# EAGLE design counter_test (EAGLE 6.4)
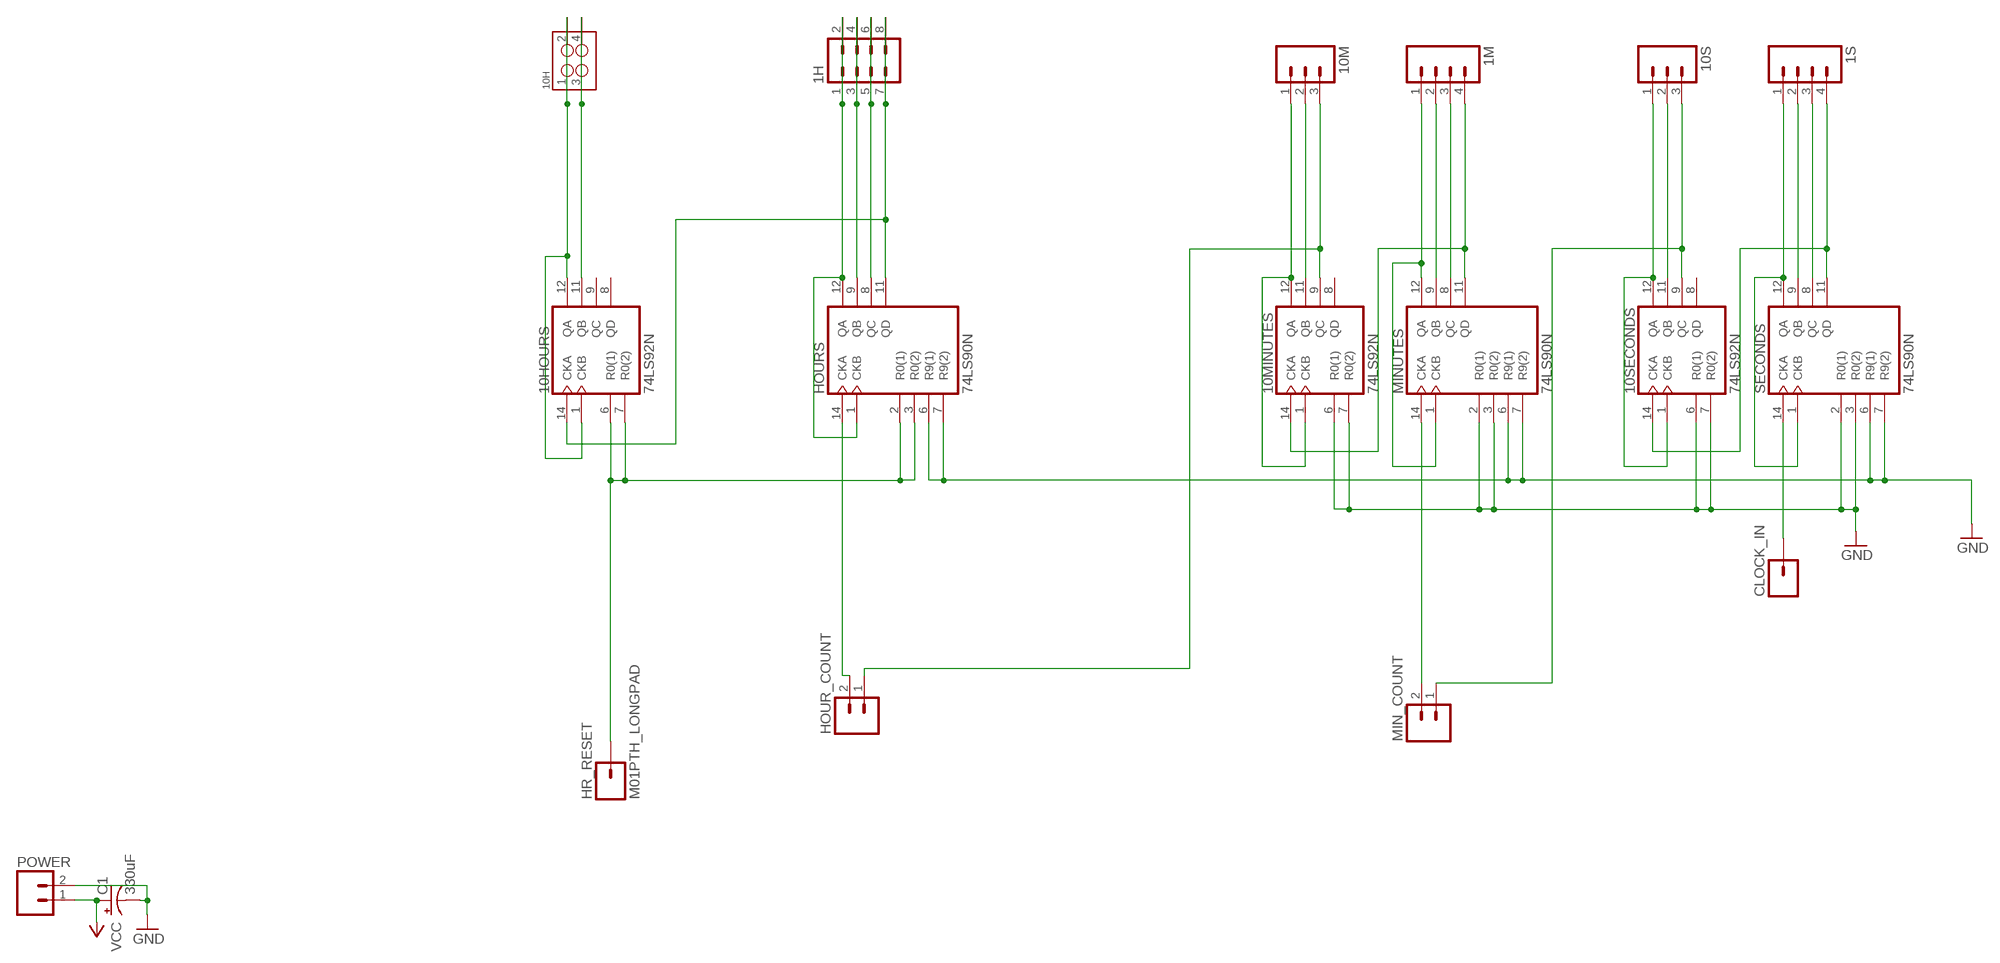
[diagram p0: schematic, sheet 1]

## Parts
1H  M04X2  [2X4]
1M  M04LONGPADS  [1X04_LONGPADS]
1S  M04LONGPADS  [1X04_LONGPADS]
10H  M02X2  [2X2]
10HOURS  74LS92N  [DIL14]
10M  M03LONGPADS  [1X03_LONGPADS]
10MINUTES  74LS92N  [DIL14]
10S  M03LONGPADS  [1X03_LONGPADS]
10SECONDS  74LS92N  [DIL14]
C1  330uF  CAPACITOR_POLE3.5-8  [E3,5-8]
CLOCK_IN  M01PTH_LONGPAD  [1X01_LONGPAD]
HOUR_COUNT  M02PTH3  [1X02_LONGPADS]
HOURS  74LS90N  [DIL14]
HR_RESET  M01PTH_LONGPAD  [1X01_LONGPAD]
MIN_COUNT  M02PTH3  [1X02_LONGPADS]
MINUTES  74LS90N  [DIL14]
POWER  M02PTH3  [1X02_LONGPADS]
SECONDS  74LS90N  [DIL14]

## Nets
1H_A: 1H.1 1H.2 HOURS.1(CKB) HOURS.12(QA)
1H_B: 1H.3 1H.4 HOURS.9(QB)
1H_C: 1H.5 1H.6 HOURS.8(QC)
1H_D: 1H.7 1H.8 10HOURS.14(CKA) HOURS.11(QD)
1M_A: 1M.1 MINUTES.1(CKB) MINUTES.12(QA)
1M_B: 1M.2 MINUTES.9(QB)
1M_C: 1M.3 MINUTES.8(QC)
1M_D: 1M.4 10MINUTES.14(CKA) MINUTES.11(QD)
1S_A: 1S.1 SECONDS.1(CKB) SECONDS.12(QA)
1S_B: 1S.2 SECONDS.9(QB)
1S_C: 1S.3 SECONDS.8(QC)
1S_D: 1S.4 10SECONDS.14(CKA) SECONDS.11(QD)
10H_A: 10H.1 10H.2 10HOURS.1(CKB) 10HOURS.12(QA)
10H_B: 10H.3 10H.4 10HOURS.11(QB)
10M_A: 10M.1 10MINUTES.1(CKB) 10MINUTES.12(QA)
10M_B: 10M.2 10MINUTES.11(QB)
10M_C: 10M.3 10MINUTES.9(QC) HOUR_COUNT.1
10S_A: 10S.1 10SECONDS.1(CKB) 10SECONDS.12(QA)
10S_B: 10S.2 10SECONDS.11(QB)
10S_C: 10S.3 10SECONDS.9(QC) MIN_COUNT.1
GND: 10MINUTES.6(R0(1)) 10MINUTES.7(R0(2)) 10SECONDS.6(R0(1)) 10SECONDS.7(R0(2)) C1.- HOURS.6(R9(1)) HOURS.7(R9(2)) MINUTES.2(R0(1)) MINUTES.3(R0(2)) MINUTES.6(R9(1)) MINUTES.7(R9(2)) POWER.2 SECONDS.2(R0(1)) SECONDS.3(R0(2)) SECONDS.6(R9(1)) SECONDS.7(R9(2))
HR_RESET: 10HOURS.6(R0(1)) 10HOURS.7(R0(2)) HOURS.2(R0(1)) HOURS.3(R0(2)) HR_RESET.1
N$1: MIN_COUNT.2 MINUTES.14(CKA)
N$15: CLOCK_IN.1 SECONDS.14(CKA)
N$21: HOUR_COUNT.2 HOURS.14(CKA)
VCC: C1.+ POWER.1
Unconnected: 10HOURS.8(QD) 10HOURS.9(QC) 10MINUTES.8(QD) 10SECONDS.8(QD)

## Power pins joined to a net without a drawn wire
GND: 10HOURS.10(GND) 10MINUTES.10(GND) 10SECONDS.10(GND) HOURS.10(GND) MINUTES.10(GND) SECONDS.10(GND)
VCC: 10HOURS.5(VCC) 10MINUTES.5(VCC) 10SECONDS.5(VCC) HOURS.5(VCC) MINUTES.5(VCC) SECONDS.5(VCC)

## Library data of the parts
1H = iStivi - Header-Connector:M04X2: .1" header, two rows of four.
1M 1S = iStivi - Header-Connector:M04: Header 4 Standard 4-pin 0.1" header. Use with straight break away headers (SKU : PRT-00116), right angle break away headers (PRT-00553), swiss pins (PRT-00743), machine pins (PRT-00117), and female headers (PRT-00115). Molex polarized connector foot print use with SKU : PRT-08231 with associated crimp pins and housings. 1MM SMD Version SKU: PRT-10208
10H = iStivi - Header-Connector:M02X2
10HOURS 10MINUTES 10SECONDS = iStivi - ICs:74*92: Divide by 12 counter
10M 10S = iStivi - Header-Connector:M03: Header 3 Standard 3-pin 0.1" header. Use with straight break away headers (SKU : PRT-00116), right angle break away headers (PRT-00553), swiss pins (PRT-00743), machine pins (PRT-00117), and female headers (PRT-00115). Molex polarized connector foot print use with SKU : PRT-08232 with associated crimp pins and housings.
C1 = iStivi - RCLD:CAPACITOR_POL: POLARIZED CAPACITOR, American symbol
CLOCK_IN HR_RESET = iStivi - Header-Connector:M01: Header 1 Standard 1-pin 0.1" header. Use with straight break away headers (SKU : PRT-00116), right angle break away headers (PRT-00553), swiss pins (PRT-00743), machine pins (PRT-00117), and female headers (PRT-00115).
HOUR_COUNT MIN_COUNT POWER = iStivi - Header-Connector:M02: Header 2 Standard 2-pin 0.1" header. Use with straight break away headers (SKU : PRT-00116), right angle break away headers (PRT-00553), swiss pins (PRT-00743), machine pins (PRT-00117), and female headers (PRT-00115). Molex polarized connector foot print use with SKU : PRT-08233 with associated crimp pins and housings.
HOURS MINUTES SECONDS = iStivi - ICs:74*90: Decade Counter BCD decade counter

## Board
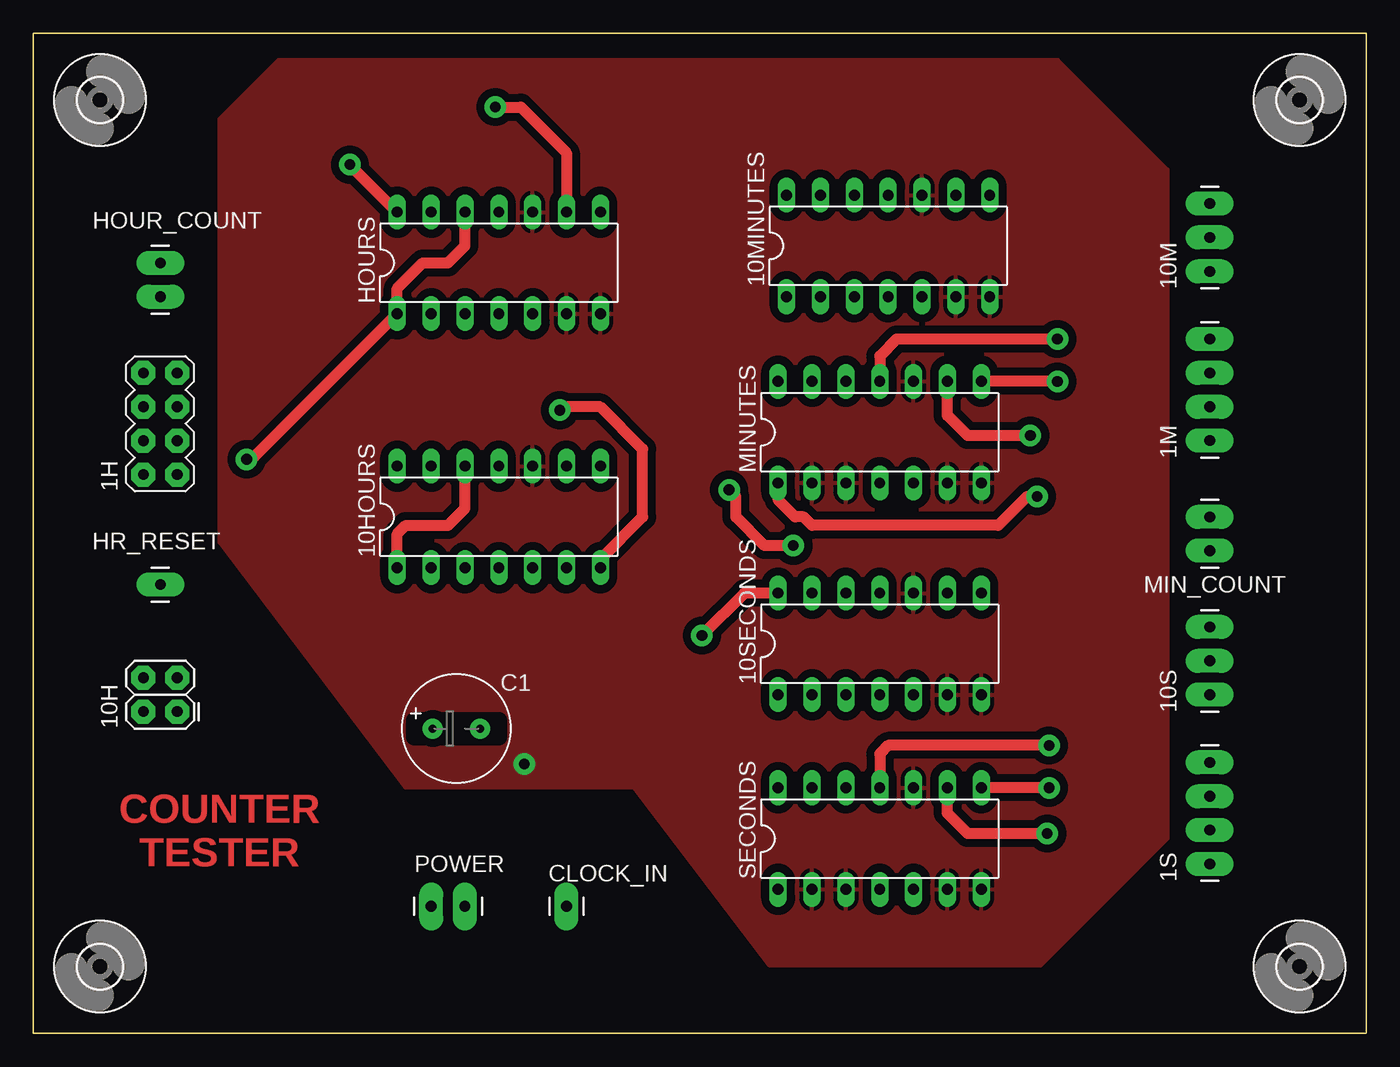
[diagram p1: board, top side]
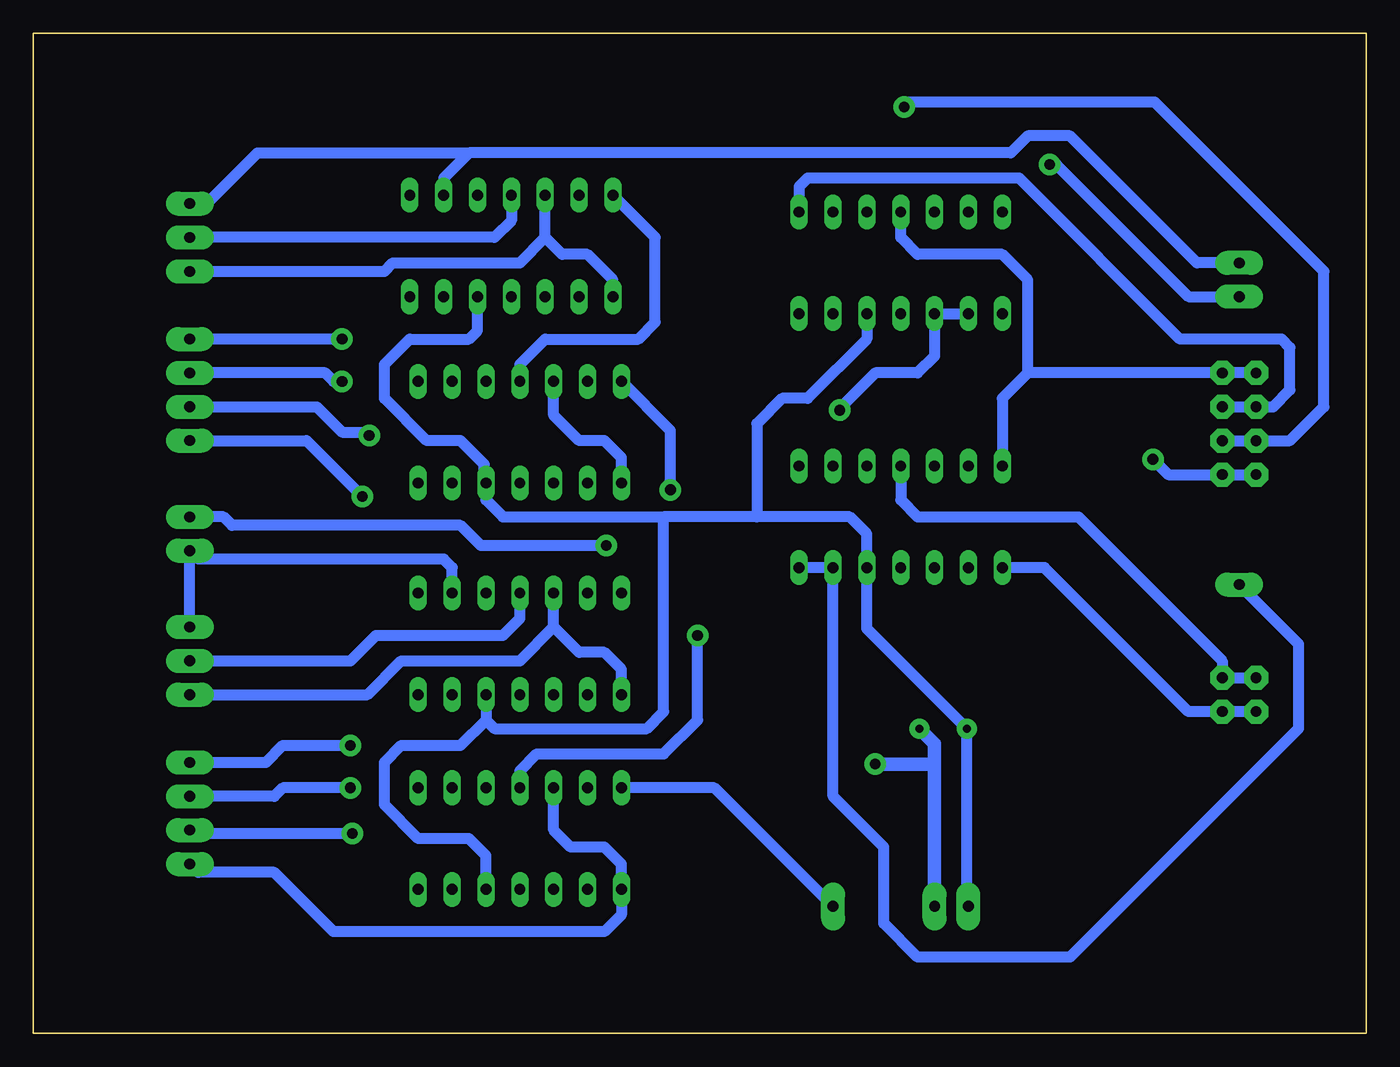
[diagram p2: board, bottom side, seen from below]

Size 100 x 75 mm. Coordinates in mm from the lower left corner, seen from the top.
Copper layers (1*16): Top 0.035mm / dielectric 1.5mm / Bottom 0.035mm
Design rules "iStivi-0.8mm via-16mil-track-12gap *": minimum track width 16mil, minimum drill 0.8mm, track to track 16mil, track to pad 16mil, pad to pad 10mil, via to via 12mil, smd to smd 10mil, copper to edge 40mil, drill to drill 8mil, minimum pad ring 10mil, minimum via ring 16mil, stop-mask expansion 0mil, vias tented up to drill 0mil, thermal gap 12mil
tRestrict: area 7.6,54 to 11.4,59.1; area 7,40.6 to 12.1,50.8; area 7.6,32.4 to 11.4,34.9; area 7,22.9 to 12.1,27.9; area 28.6,7.6 to 33.7,11.4; area 38.7,7.6 to 41.3,11.4; area 86.4,11.4 to 90.2,21.6; area 86.4,24.1 to 90.2,31.1; area 86.4,34.9 to 90.2,40; area 86.4,43.2 to 90.2,53.3; area 86.4,55.9 to 90.2,63.5; area 28.6,22.2 to 34.9,23.5

### Footprints (pad centres in the part's own frame; a part is rotated, then mirrored left to right if it is on the bottom)
2X4 = drill 0.8 pad 1.8 octagon: 1 -3.81,-1.27; 2 -3.81,1.27; 3 -1.27,-1.27; 4 -1.27,1.27; 5 1.27,-1.27; 6 1.27,1.27; 7 3.81,-1.27; 8 3.81,1.27
1X04_LONGPADS = drill 0.8 pad 1.8 long: 1 0,0; 2 2.54,0; 3 5.08,0; 4 7.62,0
2X2 = drill 0.8 pad 1.8 octagon: 1 -1.27,-1.27; 2 -1.27,1.27; 3 1.27,-1.27; 4 1.27,1.27
DIL14 = drill 0.813 long: 1 -7.62,-3.81; 2 -5.08,-3.81; 3 -2.54,-3.81; 4 0,-3.81; 5 2.54,-3.81; 6 5.08,-3.81; 7 7.62,-3.81; 8 7.62,3.81; 9 5.08,3.81; 10 2.54,3.81; 11 0,3.81; 12 -2.54,3.81; 13 -5.08,3.81; 14 -7.62,3.81
1X03_LONGPADS = drill 0.8 pad 1.8 long: 1 0,0; 2 2.54,0; 3 5.08,0
E3,5-8 = drill 0.6 pad 1.5: + -1.778,0; - 1.778,0
1X01_LONGPAD = drill 0.8 pad 1.8 long: 1 0,0
1X02_LONGPADS = drill 0.8 pad 1.8 long: 1 0,0; 2 2.54,0

### Placement (x,y rotation side)
1H  9.53,45.72 90 top
1M  88.27,44.45 90 top
1S  88.27,12.7 90 top
10H  9.53,25.4 90 top
10HOURS  34.92,38.73 0 top
10M  88.27,57.15 90 top
10MINUTES  64.14,59.05 0 top
10S  88.27,25.4 90 top
10SECONDS  63.5,29.21 0 top
C1  31.75,22.86 0 top
CLOCK_IN  40.01,9.53 0 top
HOUR_COUNT  9.53,57.78 270 top
HOURS  34.92,57.78 0 top
HR_RESET  9.53,33.66 90 top
MIN_COUNT  88.27,36.2 90 top
MINUTES  63.5,45.09 0 top
POWER  29.84,9.53 0 top
SECONDS  63.5,14.61 0 top
U$1  [BOARD-75X100]  0,0 0 top

### Tracks (layer width: path | path; a pad name or v marks a point on that pad's centre or on a via)
1H_A  (via drill 0.8)
  Top 0.813: v16,43.05 16.38,43.05 HOURS.1 27.3,55.88 29.21,57.78 31.11,57.78 32.38,59.05 HOURS.12
  Bottom 0.813: v16,43.05 14.86,41.91 1H.1 1H.2
1H_B  (via drill 0.8)
  Top 0.813: v34.67,69.47 36.58,69.47 40.01,66.04 HOURS.9
  Bottom 0.813: 1H.3 1H.4 5.71,44.45 3.17,46.99 3.17,57.15 15.88,69.85 34.29,69.85 v34.67,69.47
1H_C
  Bottom 0.813: 1H.5 1H.6 6.99,46.99 5.71,48.26 5.71,51.44 6.35,52.07 13.97,52.07 26.04,64.14 41.91,64.14 42.55,63.5 HOURS.8
1H_D
  Bottom 0.813: 1H.8 1H.7 | 11.43,49.53 1H.7 | 1H.7 25.4,49.53 | 25.4,49.53 27.3,47.62 10HOURS.14 | 25.4,49.53 25.4,56.52 27.3,58.42 33.66,58.42 34.92,59.69 HOURS.11
1M_A  (via drill 0.8)
  Top 0.813: v75.31,40.26 74.55,40.26 72.39,38.1 58.42,38.1 57.78,38.73 57.15,38.73 55.88,40.01 MINUTES.1
  Bottom 0.813: 1M.1 79.5,44.45 v75.31,40.26 | MINUTES.1 55.88,43.18 57.15,44.45 59.05,44.45 60.96,46.35 MINUTES.12
1M_B  (via drill 0.8)
  Top 0.813: v74.8,44.83 70.1,44.83 68.58,46.35 MINUTES.9
  Bottom 0.813: 1M.2 78.74,46.99 76.83,45.09 75.06,45.09 v74.8,44.83
1M_C  (via drill 0.8)
  Top 0.813: v76.83,48.9 MINUTES.8
  Bottom 0.813: v76.83,48.9 77.47,48.9 78.11,49.53 1M.3
1M_D  (via drill 0.8)
  Top 0.813: v76.83,52.07 64.77,52.07 63.5,50.8 MINUTES.11
  Bottom 0.813: v76.83,52.07 1M.4 | MINUTES.11 63.5,50.16 61.59,52.07 54.61,52.07 53.34,53.34 53.34,59.69 10MINUTES.14
1S_A
  Bottom 0.813: SECONDS.12 60.96,15.24 59.69,13.97 57.15,13.97 55.88,12.7 SECONDS.1 55.88,8.89 57.15,7.62 77.47,7.62 81.92,12.06 87.63,12.06 1S.1
1S_B  (via drill 0.8)
  Top 0.813: v76.07,14.99 70.1,14.99 68.58,16.51 SECONDS.9
  Bottom 0.813: v76.07,14.99 88.01,14.99 1S.2
1S_C  (via drill 0.8)
  Top 0.813: v76.2,18.41 SECONDS.8
  Bottom 0.813: v76.2,18.41 81.28,18.41 81.92,17.78 1S.3
1S_D  (via drill 0.8)
  Top 0.813: 10SECONDS.14 53.34,33.02 v50.16,29.84 | v76.2,21.59 64.14,21.59 63.5,20.95 SECONDS.11
  Bottom 0.813: 1S.4 82.55,20.32 81.28,21.59 v76.2,21.59 | SECONDS.11 63.5,19.68 62.23,20.95 52.7,20.95 50.16,23.5 v50.16,29.84
10H_A
  Top 0.813: 10HOURS.1 27.3,37.47 27.94,38.1 31.11,38.1 32.38,39.37 10HOURS.12
  Bottom 0.813: 10H.2 10H.1 13.34,24.13 24.13,34.92 10HOURS.1
10H_B
  Bottom 0.813: 10HOURS.11 34.92,40.01 33.66,38.73 21.59,38.73 10.79,27.94 10H.3 10H.4
10M_A
  Bottom 0.813: 10MINUTES.1 56.52,56.52 58.42,58.42 60.33,58.42 61.59,59.69 | 61.59,59.69 10MINUTES.12 | 10M.1 73.66,57.15 73.03,57.78 63.5,57.78 61.59,59.69
10M_B
  Bottom 0.813: 10MINUTES.11 64.14,60.96 65.41,59.69 10M.2
10M_C
  Bottom 0.813: HOUR_COUNT.1 12.7,57.78 22.23,67.31 25.4,67.31 26.67,66.04 67.31,66.04 | 67.31,66.04 69.22,64.14 10MINUTES.9 | 10M.3 87,62.23 83.19,66.04 67.31,66.04
10S_A
  Bottom 0.813: 10SECONDS.1 55.88,27.3 57.15,28.57 59.05,28.57 60.96,30.48 | 60.96,30.48 10SECONDS.12 | 10S.1 74.93,25.4 72.39,27.94 63.5,27.94 60.96,30.48
10S_B
  Bottom 0.813: 10S.2 76.2,27.94 74.3,29.84 64.77,29.84 63.5,31.11 10SECONDS.11
10S_C
  Bottom 0.813: 10SECONDS.9 68.58,34.92 69.22,35.56 87.63,35.56 MIN_COUNT.1 10S.3
GND  (via drill 0.8)
  Bottom 1.016: POWER.2 32.38,20.32 | 32.38,20.32 32.38,21.72 C1.- | v36.83,20.19 32.51,20.19 32.38,20.32
  pour Top (isolate 0.61): 18.41,73.03 76.83,73.03 85.09,64.77 85.09,14.61 75.56,5.08 55.24,5.08 45.09,18.41 27.94,18.41 13.97,36.83 13.97,68.58
HR_RESET  (via drill 0.8)
  Top 0.813: 10HOURS.7 42.55,35.56 45.72,38.73 45.72,43.81 42.55,46.99 39.75,46.99 v39.5,46.74
  Bottom 0.813: HR_RESET.1 5.08,29.21 5.08,22.86 22.23,5.71 33.66,5.71 36.2,8.26 36.2,13.97 40.01,17.78 10HOURS.6 10HOURS.7 | 39.37,46.61 39.37,46.99 36.83,49.53 33.66,49.53 32.38,50.8 HOURS.3 HOURS.2 | 39.37,46.35 39.37,46.61 | 39.37,46.61 v39.5,46.74
N$1  (via drill 0.8)
  Top 0.813: v57.02,36.58 54.86,36.58 52.7,38.73 52.7,40.26 v52.2,40.77
  Bottom 0.406: MIN_COUNT.2 87.76,38.73
  Bottom 0.813: v57.02,36.58 66.42,36.58 67.94,38.1 85.09,38.1 85.72,38.73 MIN_COUNT.2 | v52.2,40.77 52.2,45.21 MINUTES.14
N$15
  Bottom 0.813: CLOCK_IN.1 48.9,18.41 SECONDS.14
N$21  (via drill 0.8)
  Top 0.813: v23.75,65.15 HOURS.14
  Bottom 0.813: v23.75,65.15 23.24,65.15 13.34,55.24 HOUR_COUNT.2
VCC
  Bottom 0.406: 66.17,41.4 MINUTES.5 | 29.84,22.73 C1.+
  Bottom 0.813: POWER.1 29.97,9.65 C1.+ 37.47,30.35 10HOURS.5 37.47,37.47 38.73,38.73 45.72,38.73 | SECONDS.5 66.04,13.34 67.31,14.61 71.12,14.61 73.66,17.14 73.66,20.32 72.39,21.59 67.94,21.59 66.04,23.5 | 10SECONDS.5 66.04,23.5 | 66.04,23.5 65.41,22.86 53.98,22.86 52.7,24.13 52.7,38.73 | MINUTES.5 66.04,40.01 64.77,38.73 52.7,38.73 | 66.17,41.4 66.17,42.67 67.94,44.45 70.48,44.45 73.66,47.62 73.66,50.16 71.75,52.07 67.31,52.07 66.67,52.7 10MINUTES.5 | 45.72,38.73 52.7,38.73 | HOURS.5 37.47,52.07 41.91,47.62 43.81,47.62 45.72,45.72 45.72,38.73

### Text on the board
Top: COUNTER / TESTER